# Altium schematic sheet GTM_LeftJawGrippersMotorsConnectors.SchDoc
size A4
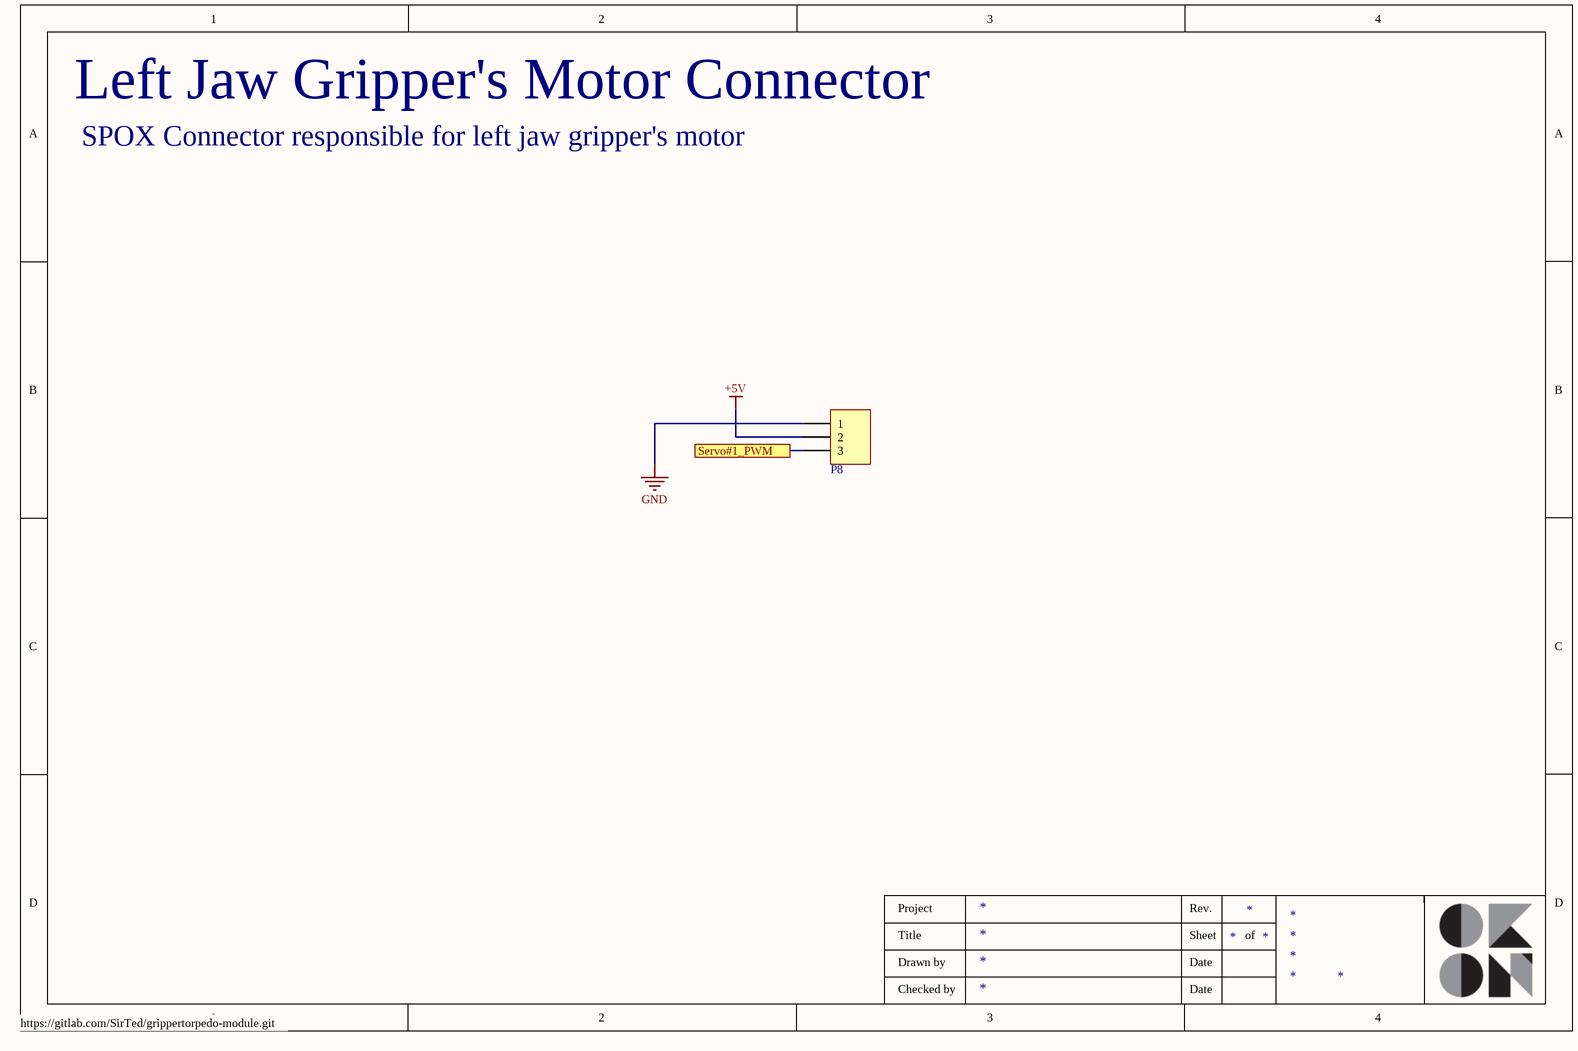
[diagram p0: GTM_LeftJawGrippersMotorsConnectors.SchDoc]

## Parts
P8  HDR1X3  [Molex SPOX Horizontal 3 Circuits]  (value not drawn)

## Ports
Servo#1_PWM

## Nets
+5V: P8.2
GND: P8.1
Servo#1_PWM: P8.3 ; port Servo#1_PWM

## Notes on the sheet
- Left Jaw Gripper's Motor Connector
- SPOX Connector responsible for left jaw gripper's motor
- https://gitlab.com/SirTed/grippertorpedo-module.git
- Project
- Rev.
- Title
- Drawn by
- Date
- Sheet
- of
- Checked by

## Library data of the parts
P8 = HDR1X3: Header, 3-Pin; LatestRevisionDate: 17-Jul-2002; LatestRevisionNote: Re-released for DXP Platform.; Publisher: Altium Limited